# EAGLE design polarshield v1.2 2012.11.02 (EAGLE 5.11)
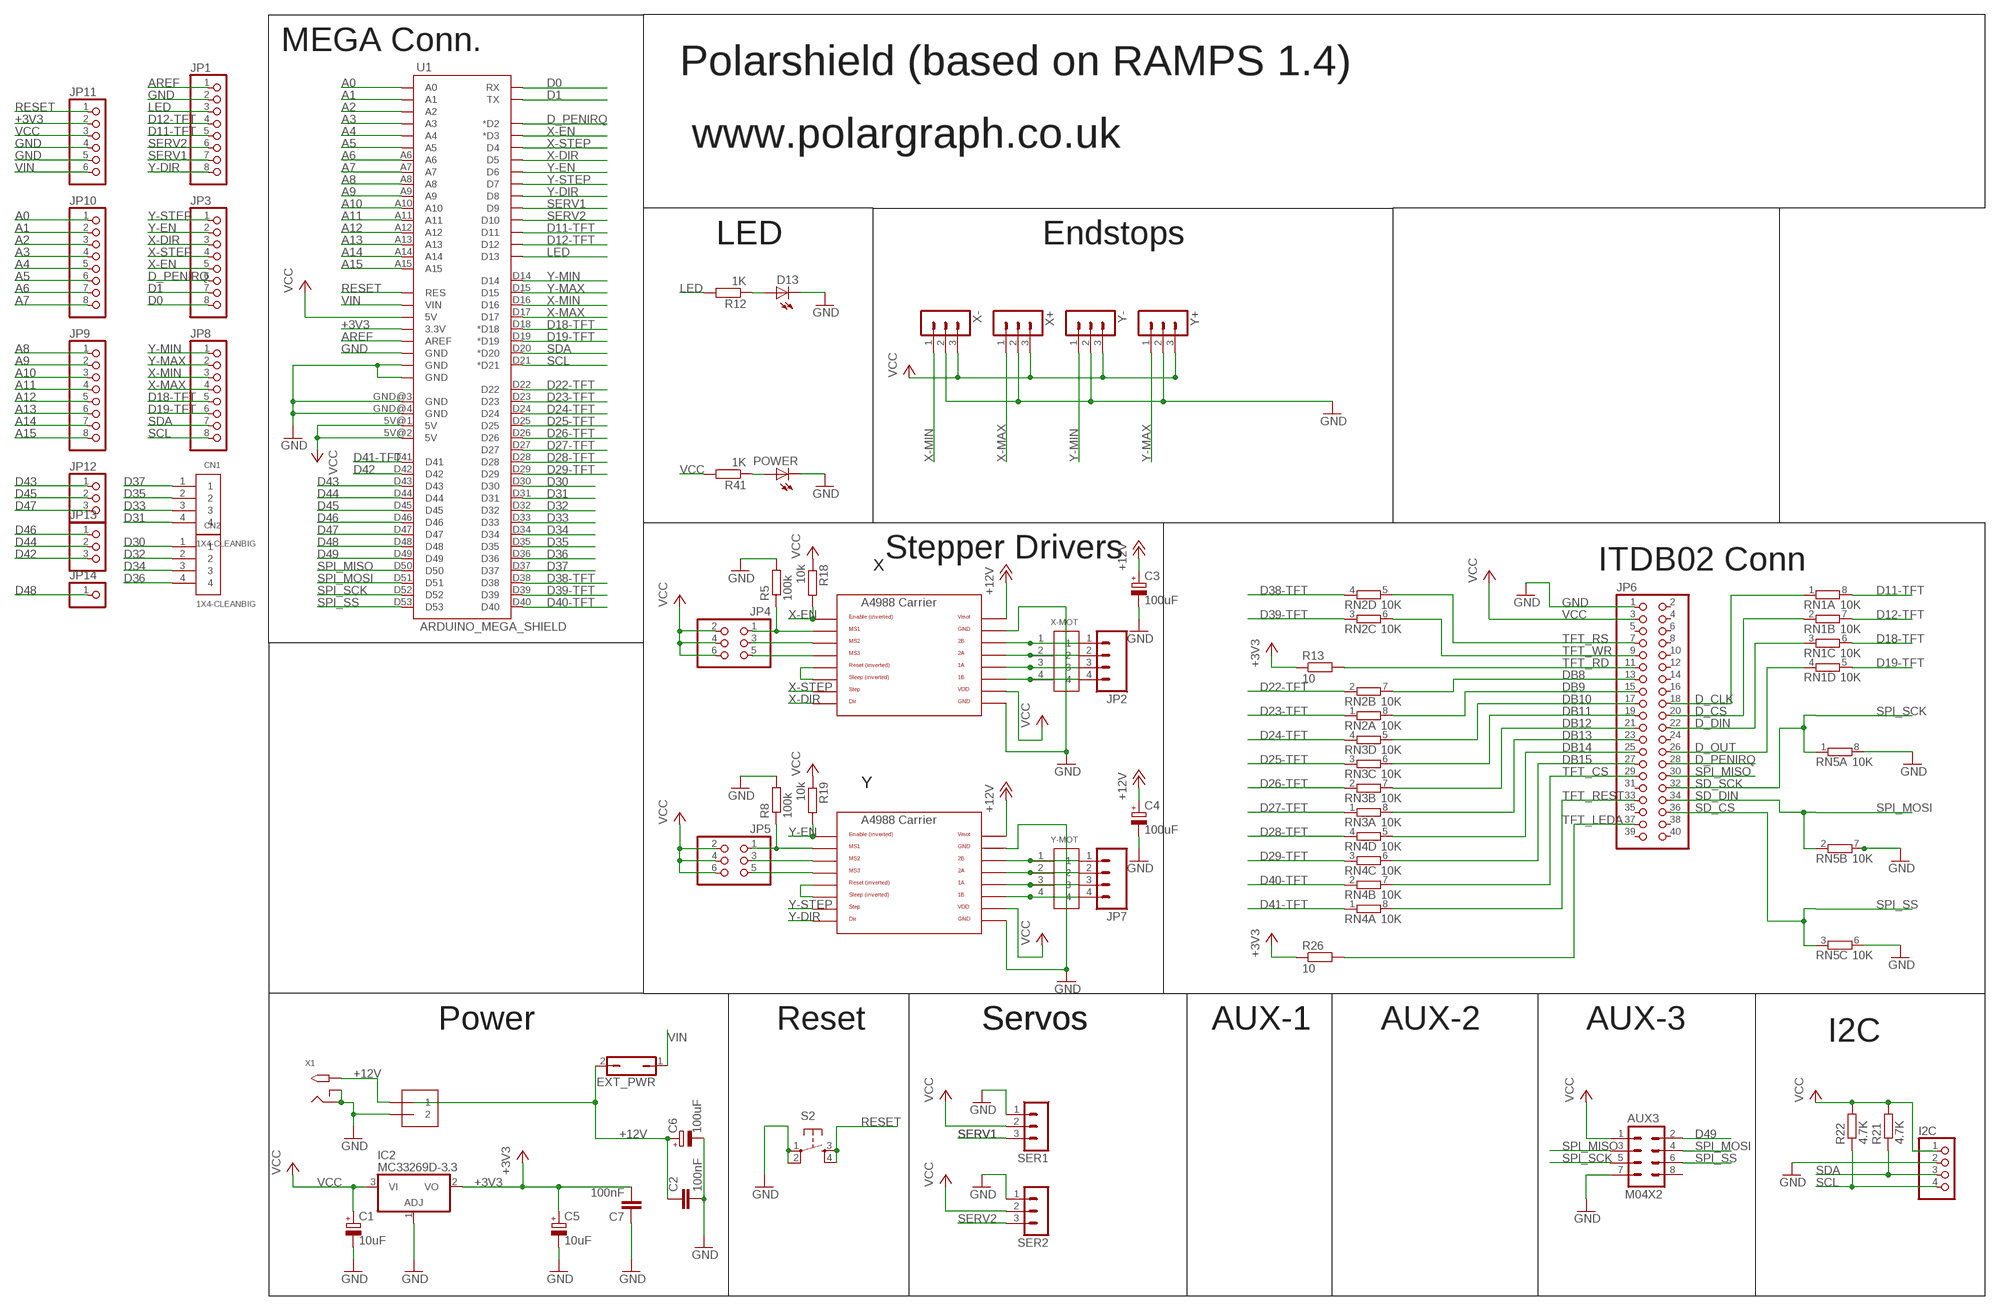
[diagram p0: schematic, sheet 1, part 1 of 2]
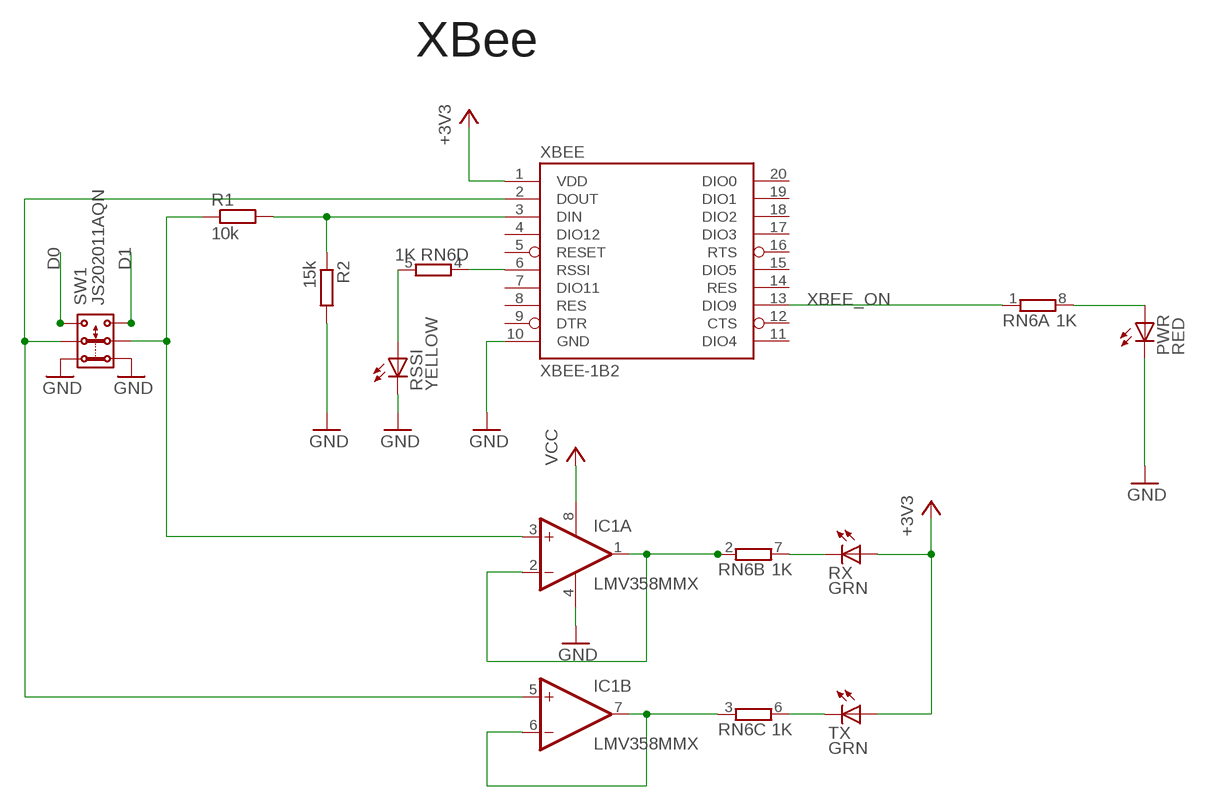
[diagram p1: schematic, sheet 1, part 2 of 2]

## Parts
AUX3  M04X2  [2X4]
C1  10uF  CPOL-EUCT3528  [CT3528]
C2  100nF  C-EUC0805  [C0805]
C3  100uF  CPOL-EU153CLV-0605  [153CLV-0605]
C4  100uF  CPOL-EU153CLV-0605  [153CLV-0605]
C5  10uF  CPOL-EUCT3528  [CT3528]
C6  100uF  CPOL-EU153CLV-0605  [153CLV-0605]
C7  100nF  C-EUC0805  [C0805]
CN1  1X4-CLEANBIG  [1X04-CLEANBIG]
CN2  1X4-CLEANBIG  [1X04-CLEANBIG]
D13  LEDCHIP-LED0805  [CHIP-LED0805]
EXT_PWR  JP1Q  [JP1]
I2C  PINHD-1X4  [1X04]
IC1  LMV358MMX  [MSOP08]
IC2  MC33269D-3.3  [DPACK]
J1  1X2-3.5MM  [1X2-3.5MM]
JP1  PINHD-1X8CLEANBIG  [1X08-CLEANBIG]
JP2  M04SCREW  [SCREWTERMINAL-3.5MM-4]
JP3  PINHD-1X8CLEANBIG  [1X08-CLEANBIG]
JP4  PINHD-2X3  [2X03]
JP5  PINHD-2X3  [2X03]
JP6  PINHD-2X20  [2X20]
JP7  M04SCREW  [SCREWTERMINAL-3.5MM-4]
JP8  PINHD-1X8CLEANBIG  [1X08-CLEANBIG]
JP9  PINHD-1X8CLEANBIG  [1X08-CLEANBIG]
JP10  PINHD-1X8CLEANBIG  [1X08-CLEANBIG]
JP11  PINHD-1X6CB  [1X06-CLEANBIG]
JP12  PINHD-1X3CB  [1X03-CLEANBIG]
JP13  PINHD-1X3CB  [1X03-CLEANBIG]
JP14  PINHD-1X1CB  [1X01-CLEANBIG]
POWER  LEDCHIP-LED0805  [CHIP-LED0805]
PWR  RED  LEDCHIPLED_0805  [CHIPLED_0805]
R1  10k  R-EU_R0805  [R0805]
R2  15k  R-EU_R0805  [R0805]
R5  100k  R-EU_R0805  [R0805]
R8  100k  R-EU_R0805  [R0805]
R12  1K  R-EU_R0805  [R0805]
R13  10  R-EU_R0805  [R0805]
R18  10k  R-EU_R0805  [R0805]
R19  10k  R-EU_R0805  [R0805]
R21  4.7K  R-EU_R0805  [R0805]
R22  4.7K  R-EU_R0805  [R0805]
R26  10  R-EU_R0805  [R0805]
R41  1K  R-EU_R0805  [R0805]
RN1  10K  4R-NEXBS8V  [EXBS8V]
RN2  10K  4R-NEXBS8V  [EXBS8V]
RN3  10K  4R-NEXBS8V  [EXBS8V]
RN4  10K  4R-NEXBS8V  [EXBS8V]
RN5  10K  4R-NEXBS8V  [EXBS8V]
RN6  1K  4R-NEXBS8V  [EXBS8V]
RSSI  YELLOW  LEDCHIPLED_0805  [CHIPLED_0805]
RX  GRN  LEDCHIPLED_0805  [CHIPLED_0805]
S2  TAC_SWITCHPTH  [TACTILE-PTH]
SER1  3PIN-HEADER  [3PIN-HEADER]
SER2  3PIN-HEADER  [3PIN-HEADER]
SW1  JS202011AQN  [JS202011AQN]
TX  GRN  LEDCHIPLED_0805  [CHIPLED_0805]
U1  ARDUINO_MEGA_SHIELD  [ARDUINO_MEGA_SHIELD]
U$6  A4988BREAKOUT  [A4988BREAKOUT]
U$7  A4988BREAKOUT  [A4988BREAKOUT]
X1  2.1MMJACKTHM  [PJ-102A]
X+  3PIN-HEADER  [3PIN-HEADER]
X-  3PIN-HEADER  [3PIN-HEADER]
X-MOT  1X4-BIG  [1X04-BIG]
XBEE  XBEE-1B2  [XBEE-SILK]
Y+  3PIN-HEADER  [3PIN-HEADER]
Y-  3PIN-HEADER  [3PIN-HEADER]
Y-MOT  1X4-BIG  [1X04-BIG]

## Nets
+3V3: C5.+ C7.2 IC2.2(VO) JP11.2 R13.1 R26.1 RX.A TX.A U1.3.3V XBEE.1(VDD)
+12V [vcc]: C2.1 C3.+ C4.+ C6.+ EXT_PWR.2 J1.1 U$6.VMOT U$7.VMOT X1.TIP
A0: JP10.1 U1.A0
A1: JP10.2 U1.A1
A2: JP10.3 U1.A2
A3: JP10.4 U1.A3
A4: JP10.5 U1.A4
A5: JP10.6 U1.A5
A6: JP10.7 U1.A6
A7: JP10.8 U1.A7
A8: JP9.1 U1.A8
A9: JP9.2 U1.A9
A10: JP9.3 U1.A10
A11: JP9.4 U1.A11
A12: JP9.5 U1.A12
A13: JP9.6 U1.A13
A14: JP9.7 U1.A14
A15: JP9.8 U1.A15
AREF: JP1.1 U1.AREF
D0: JP3.8 SW1.A3(3.1) U1.RX
D1: JP3.7 SW1.B3(3.2) U1.TX
D11-TFT: JP1.5 RN1.8 U1.D11
D12-TFT: JP1.4 RN1.7 U1.D12
D18-TFT: JP8.5 RN1.6 U1.D18(*D18)
D19-TFT: JP8.6 RN1.5 U1.D19(*D19)
D22-TFT: RN2.2 U1.D22
D23-TFT: RN2.1 U1.D23
D24-TFT: RN3.4 U1.D24
D25-TFT: RN3.3 U1.D25
D26-TFT: RN3.2 U1.D26
D27-TFT: RN3.1 U1.D27
D28-TFT: RN4.4 U1.D28
D29-TFT: RN4.3 U1.D29
D30: CN2.1 U1.D30
D31: CN1.4 U1.D31
D32: CN2.2 U1.D32
D33: CN1.3 U1.D33
D34: CN2.3 U1.D34
D35: CN1.2 U1.D35
D36: CN2.4 U1.D36
D37: CN1.1 U1.D37
D38-TFT: RN2.4 U1.D38
D39-TFT: RN2.3 U1.D39
D40-TFT: RN4.2 U1.D40
D41-TFT: RN4.1 U1.D41
D42: JP13.3 U1.D42
D43: JP12.1 U1.D43
D44: JP13.2 U1.D44
D45: JP12.2 U1.D45
D46: JP13.1 U1.D46
D47: JP12.3 U1.D47
D48: JP14.1 U1.D48
D49: AUX3.2 U1.D49
D_CLK: JP6.18 RN1.1
D_CS: JP6.20 RN1.2
D_DIN: JP6.22 RN1.3
D_OUT: JP6.26 RN1.4
D_PENIRQ: JP3.6 JP6.28 U1.D2(*D2)
DB8: JP6.13 RN2.7
DB9: JP6.15 RN2.8
DB10: JP6.17 RN3.5
DB11: JP6.19 RN3.6
DB12: JP6.21 RN3.7
DB13: JP6.23 RN3.8
DB14: JP6.25 RN4.5
DB15: JP6.27 RN4.6
GND: AUX3.7 C1.- C2.2 C3.- C4.- C5.- C6.- C7.1 D13.C I2C.2 IC1.4(P:V-) IC2.1(ADJ) J1.2 JP1.2 JP6.1 JP11.4 JP11.5 POWER.C PWR.C R2.2 R5.2 R8.2 RN5.6 RN5.7 RN5.8 RSSI.C S2.1 S2.2 SER1.1 SER2.1 SW1.A1(1.1) SW1.B1(1.2) U1.GND@0(GND) U1.GND@1(GND) U1.GND@2(GND) U1.GND@3(GND) U1.GND@4(GND) U$6.GND U$6.GND@0(GND) U$7.GND U$7.GND@0(GND) X1.RING X1.RING_SW X+.2 X-.2 XBEE.10(GND) Y+.2 Y-.2
LED: JP1.3 R12.2 U1.D13
N$1: U$6.RST U$6.SLP(SLEEP)
N$2: POWER.A R41.1
N$4: RN6.6 TX.C
N$5: RN6.5 RSSI.A
N$6: IC1.6(B:-IN) IC1.7(B:OUT) RN6.3
N$7: PWR.A RN6.8
N$8: RN6.4 XBEE.6(RSSI)
N$9: IC1.1(A:OUT) IC1.2(A:-IN) RN6.2
N$11: RN6.7 RX.C
N$13: U$7.RST U$7.SLP(SLEEP)
N$14: JP4.1 R5.1 U$6.MS1
N$15: JP4.3 U$6.MS2
N$16: IC1.3(A:+IN) R1.1 SW1.B2(2.2)
N$17: JP5.3 U$7.MS2
N$19: JP4.5 U$6.MS3
N$21: JP2.1 U$6.2B X-MOT.1
N$22: JP2.2 U$6.2A X-MOT.2
N$24: IC1.5(B:+IN) SW1.A2(2.1) XBEE.2(DOUT)
N$26: JP2.3 U$6.1A X-MOT.3
N$27: JP2.4 U$6.1B X-MOT.4
N$28: JP7.1 U$7.2B Y-MOT.1
N$29: JP7.2 U$7.2A Y-MOT.2
N$30: JP7.3 U$7.1A Y-MOT.3
N$31: JP5.5 U$7.MS3
N$32: R1.2 R2.1 XBEE.3(DIN)
N$33: JP5.1 R8.1 U$7.MS1
N$36: JP7.4 U$7.1B Y-MOT.4
N$46: D13.A R12.1
RESET: JP11.1 S2.3 S2.4 U1.RES
SCL: I2C.4 JP8.8 R22.1 U1.D21(*D21)
SD_CS: JP6.36 RN5.3
SD_DIN: JP6.34 RN5.2
SD_SCK: JP6.32 RN5.1
SDA: I2C.3 JP8.7 R21.1 U1.D20(*D20)
SERV1: JP1.7 SER1.3 U1.D9
SERV2: JP1.6 SER2.3 U1.D10
SPI_MISO: AUX3.3 JP6.30 U1.D50
SPI_MOSI: AUX3.4 U1.D51
SPI_SCK: AUX3.5 U1.D52
SPI_SS: AUX3.6 U1.D53
TFT_CS: JP6.29 RN4.7
TFT_LEDA: JP6.37 R26.2
TFT_RD: JP6.11 R13.2
TFT_REST: JP6.33 RN4.8
TFT_RS: JP6.7 RN2.5
TFT_WR: JP6.9 RN2.6
VCC: AUX3.1 C1.+ I2C.1 IC1.8(P:V+) IC2.3(VI) JP4.2 JP4.4 JP4.6 JP5.2 JP5.4 JP5.6 JP6.3 JP11.3 R18.1 R19.1 R21.2 R22.2 R41.2 SER1.2 SER2.2 U1.5V@0(5V) U1.5V@1(5V) U1.5V@2(5V) U$6.VDD U$7.VDD X+.3 X-.3 Y+.3 Y-.3
VIN [vcc]: EXT_PWR.1 JP11.6 U1.VIN
X-DIR: JP3.3 U1.D5 U$6.DIR
X-EN: JP3.5 R18.2 U1.D3(*D3) U$6.EN
X-MAX: JP8.4 U1.D17 X+.1
X-MIN: JP8.3 U1.D16 X-.1
X-STEP: JP3.4 U1.D4 U$6.STEP
XBEE_ON: RN6.1 XBEE.13(DIO9)
Y-DIR: JP1.8 U1.D8 U$7.DIR
Y-EN: JP3.2 R19.2 U1.D6 U$7.EN
Y-MAX: JP8.2 U1.D15 Y+.1
Y-MIN: JP8.1 U1.D14 Y-.1
Y-STEP: JP3.1 U1.D7 U$7.STEP
Unconnected: AUX3.8 JP6.2 JP6.4 JP6.5 JP6.6 JP6.8 JP6.10 JP6.12 JP6.14 JP6.16 JP6.24 JP6.31 JP6.35 JP6.38 JP6.39 JP6.40 RN5.4 RN5.5 XBEE.4(DIO12) XBEE.5(RESET) XBEE.7(DIO11) XBEE.8(RES) XBEE.9(DTR) XBEE.11(DIO4) XBEE.12(CTS) XBEE.14(RES) XBEE.15(DIO5) XBEE.16(RTS) XBEE.17(DIO3) XBEE.18(DIO2) XBEE.19(DIO1) XBEE.20(DIO0)

## Notes on the sheet
- MEGA Conn.
- Polarshield (based on RAMPS 1.4)
- www.polargraph.co.uk
- LED | Endstops
- XBee
- Stepper Drivers
- X | ITDB02 Conn
- Y
- Power | Reset | Servos | Servos | AUX-1 | AUX-2 | AUX-3
- I2C

## Library data of the parts
AUX3 = SparkFun:M04X2
C1 C3-C6 = rcl:CPOL-EU: POLARIZED CAPACITOR, European symbol
C2 C7 = resistor:C-EU: CAPACITOR, European symbol
CN1 CN2 X-MOT Y-MOT = adafruit:1X4: 4-pin connector
D13 POWER PWR RSSI RX TX = led:LED: LED OSRAM: - CHIPLED LG R971, LG N971, LY N971, LG Q971, LY Q971, LO R971, LY R971 LH N974, LH R974 LS Q976, LO Q976, LY Q976 LO Q996 - Hyper CHIPLED LW Q18S LB Q993, LB Q99A, LB R99A - SideLED LS A670, LO A670, LY A670, LG A670, LP A670 LB A673, LV A673, LT A673, LW A673 LH A674 LY A675 LS A676, LA A676, LO A676, LY A676, LW A676 LS A679, LY A679, LG A679 - Hyper Micro SIDELED® LS Y876, LA Y876, LO Y876, LY Y876 LT Y87S - SmartLED LW L88C, LW L88S LB L89C, LB L89S, LG L890 LS L89K, LO L89K, LY L89K LS L896, LA L896, LO L896, LY L896 - TOPLED LS T670, LO T670, LY T670, LG T670, LP T670 LSG T670, LSP T670, LSY T670, LOP T670, LYG T670 LG T671, LOG T671, LSG T671 LB T673, LV T673, LT T673, LW T673 LH T674 LS T676, LA T676, LO T676, LY T676, LB T676, LH T676, LSB T676, LW T676 LB T67C, LV T67C, LT T67C, LS T67K, LO T67K, LY T67K, LW E67C LS E67B, LA E67B, LO E67B, LY E67B, LB E67C, LV E67C, LT E67C LW T67C LS T679, LY T679, LG T679 LS T770, LO T770, LY T770, LG T770, LP T770 LB T773, LV T773, LT T773, LW T773 LH T774 LS E675, LA E675, LY E675, LS T675 LS T776, LA T776, LO T776, LY T776, LB T776 LHGB T686 LT T68C, LB T68C - Hyper Mini TOPLED® LB M676 - Mini TOPLED Santana® LG M470 LS M47K, LO M47K, LY M47K Source: http://www.osram.convergy.de LUXEON: - LUMILED® LXK2-PW12-R00, LXK2-PW12-S00, LXK2-PW14-U00, LXK2-PW14-V00 LXK2-PM12-R00, LXK2-PM12-S00, LXK2-PM14-U00 LXK2-PE12-Q00, LXK2-PE12-R00, LXK2-PE12-S00, LXK2-PE14-T00, LXK2-PE14-U00 LXK2-PB12-K00, LXK2-PB12-L00, LXK2-PB12-M00, LXK2-PB14-N00, LXK2-PB14-P00, LXK2-PB14-Q00 LXK2-PR12-L00, LXK2-PR12-M00, LXK2-PR14-Q00, LXK2-PR14-R00 LXK2-PD12-Q00, LXK2-PD12-R00, LXK2-PD12-S00 LXK2-PH12-R00, LXK2-PH12-S00 LXK2-PL12-P00, LXK2-PL12-Q00, LXK2-PL12-R00 Source: www.luxeon.com KINGBRIGHT: KA-3528ASYC Source: www.kingbright.com
EXT_PWR = jumper:JP1Q: JUMPER
I2C = RepRapjr:PINHD-1X4: PIN HEADER
IC1 = linear:LMV358?*: Dual General Purpose, Low Voltage, Rail-to-Rail Output Operational Amplifiers Source: http://www.national.com/mpf/LM/LMV321.html http://www.national.com/dt/lmv_qual.pdf
IC2 = linear:MC33269?*: Adjustable Output Low Dropout Voltage Regulator 800 mA Source: http://www.onsemi.com/pub/Collateral/MC33269-D.PDF
J1 = adafruit:1X2: 3.5mm Terminal block http://www.ladyada.net/library/pcb/eaglelibrary.html
JP1 JP3 JP8-JP10 = adafruit:PINHD-1X8: PIN HEADER
JP2 JP7 = SparkFun:M04: Header 4 Standard 4-pin 0.1" header. Use with straight break away headers (SKU : PRT-00116), right angle break away headers (PRT-00553), swiss pins (PRT-00743), machine pins (PRT-00117), and female headers (PRT-00115). Molex polarized connector foot print use with SKU : PRT-08231 with associated crimp pins and housings. 1MM SMD Version SKU: PRT-10208
JP4 JP5 = pinhead:PINHD-2X3: PIN HEADER
JP6 = pinhead:PINHD-2X20: PIN HEADER
JP11 = adafruit:PINHD-1X6: PIN HEADER
JP12 JP13 = adafruit:PINHD-1X3: PIN HEADER
JP14 = adafruit:PINHD-1X1: Pin header 1x1 for 0.1" spacing With round pins
R1 R13 R26 = resistor:R-EU_: RESISTOR, European symbol
R2 R5 R8 R12 R18 R19 R21 R22 R41 = rcl:R-EU_: RESISTOR, European symbol
RN1-RN6 = resistor-dil:4R-N: Array Chip Resistor Source: RS Component / Phycomp; OC_FARNELL: unknown; OC_NEWARK: unknown
S2 = SparkFun:TAC_SWITCH: Momentary Switch Button commonly used for reset or general input. Spark Fun Electronics SKU : COM-00097
SER1 SER2 X+ X- Y+ Y- = ultimachine:3PIN-HEADER: PIN HEADER
SW1 = sandynoble:JS202011AQN
U1 = RepRapjr:ARDUINO_MEGA_SHIELD
U$6 U$7 = RepRapjr:A4988BREAKOUT
X1 = adafruit:2.1MMJACK: 2.1mm x 5.5mm THM DC jack with internal switch. Digikey part #PJ-102A, 4UCON part #05537 2.1mm x 5.5mm SMT DC jack with internal switch. Digikey part #PJ-002A-SMT, 4UCON part #03267 By microbuilder.eu & adafruit.com
XBEE = SparkFun:XBEE-1

## Net classes
1 gnd12: width 2.54 mm
2 gnd5: width 2.54 mm
3 vmot: width 2.54 mm
4 vcc: width 0.406 mm
5 signal: width 0.406 mm

## Board
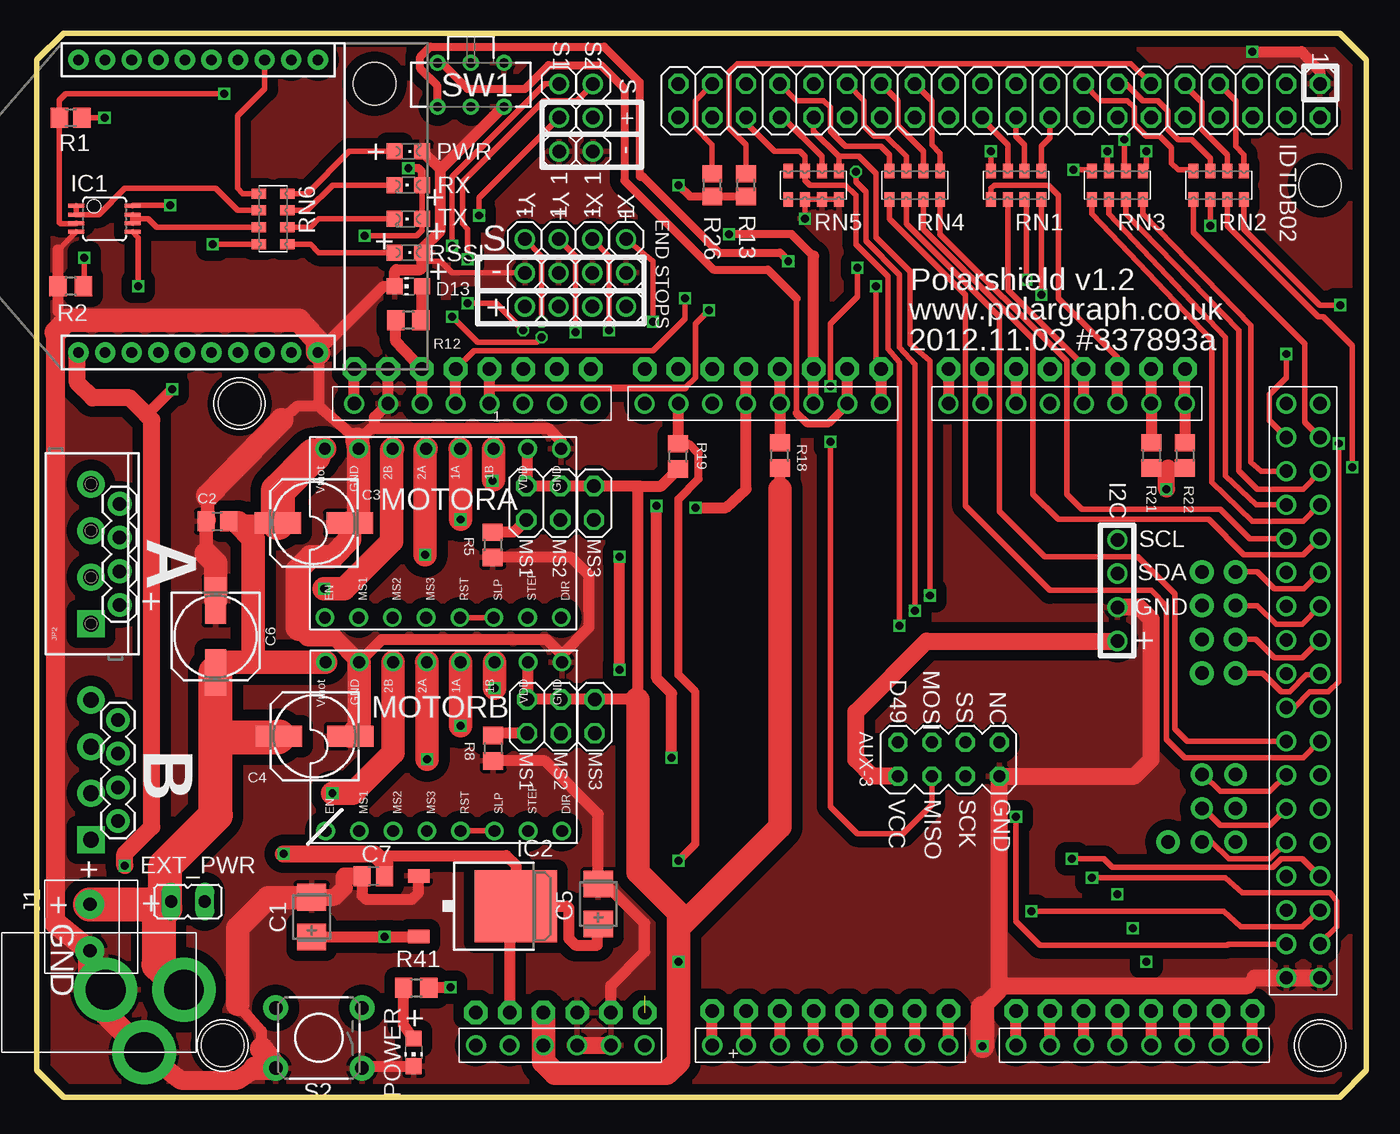
[diagram p2: board, top side]
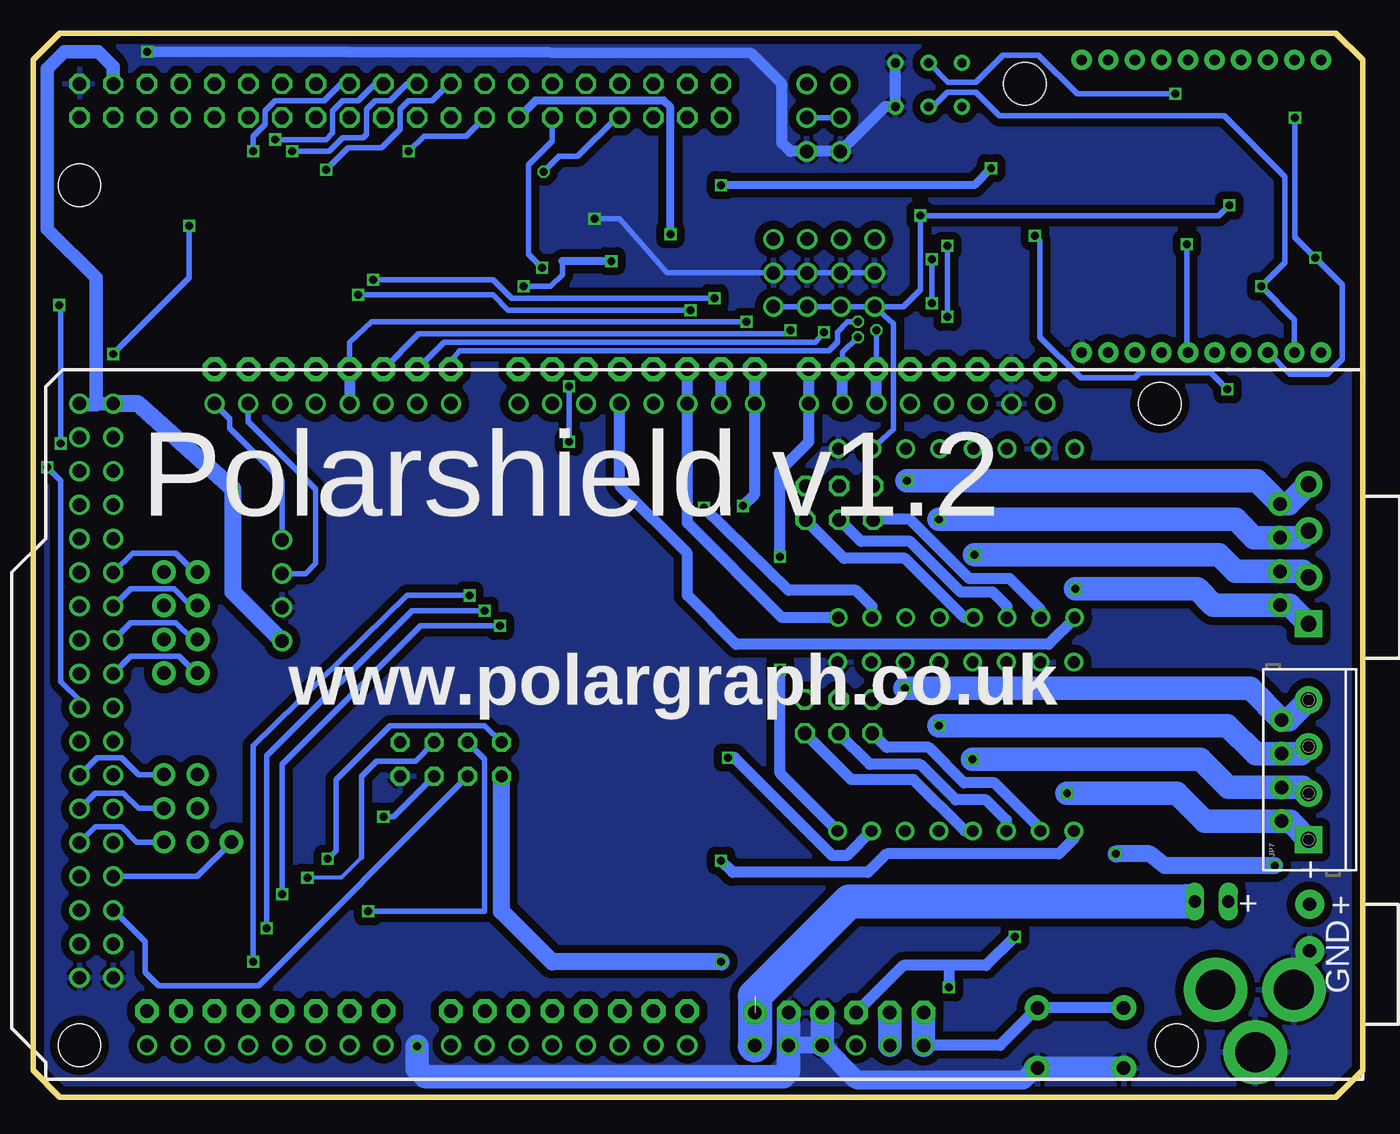
[diagram p3: board, bottom side, seen from below]

Size 100 x 80 mm. Coordinates in mm from the lower left corner, seen from the top.
Outline: 100,2 100,78 98,80 2,80 0,78 0,2 2,0 98,0 100,2
Copper layers (1*16): Top 0.035mm / dielectric 1.5mm / Bottom 0.035mm
Design rules "ITead_rule": minimum track width 6mil, minimum drill 12mil, track to track 6mil, track to pad 6mil, pad to pad 6mil, via to via 6mil, smd to smd 0mil, copper to edge 10mil, drill to drill 10mil, minimum pad ring 10mil, minimum via ring 6mil, stop-mask expansion 2mil, vias tented up to drill 100mil, thermal gap 10mil
Holes 3.2 mm at 25.4,76.2 96.52,68.58

### Footprints (pad centres in the part's own frame; a part is rotated, then mirrored left to right if it is on the bottom)
2X4 = drill 0.9 pad 1.422 octagon: 1 -3.81,-1.27; 2 -3.81,1.27; 3 -1.27,-1.27; 4 -1.27,1.27; 5 1.27,-1.27; 6 1.27,1.27; 7 3.81,-1.27; 8 3.81,1.27
CT3528 = smd 2 x 2.2: + -1.5,0; - 1.5,0
C0805 = smd 1.3 x 1.5: 1 -0.85,0; 2 0.85,0
153CLV-0605 = smd 3.5 x 1.6: + 2.7,0; - -2.7,0
1X04-CLEANBIG = drill 1.016 pad 1.778 round: 1 -3.81,0; 2 -1.27,0; 3 1.27,0; 4 3.81,0
CHIP-LED0805 = smd 1.2 x 1.2: A 0,-1.05; C 0,1.05
JP1 = drill 0.914 long: 1 0,-1.27; 2 0,1.27
1X04 = drill 1.016 round: 1 -2.54,0; 2 0,0; 3 2.54,0; 4 5.08,0
MSOP08 = smd 0.3 x 1.2: 1 -0.976,-2.113; 2 -0.326,-2.113; 3 0.324,-2.113; 4 0.974,-2.113; 5 0.974,2.112; 6 0.324,2.112; 7 -0.326,2.112; 8 -0.976,2.112
DPACK = smd 1 x 1.6: 1 -2.28,-4.8; 3 2.28,-4.8 | smd 5.4 x 6.2: 2 0,2.5
1X2-3.5MM = drill 1 pad 2.184 round: 1 1.8,0; 2 -1.7,0
1X08-CLEANBIG = drill 1.016 pad 1.778 octagon: 1 -8.89,0; 2 -6.35,0; 3 -3.81,0; 4 -1.27,0; 5 1.27,0; 6 3.81,0; 7 6.35,0; 8 8.89,0
SCREWTERMINAL-3.5MM-4 = drill 1.2 pad 2.032 square: 1 0,0 | drill 1.2 pad 2.032 round: 2 3.5,0; 3 7,0; 4 10.5,0
2X03 = drill 1.016 octagon: 1 -2.54,-1.27; 2 -2.54,1.27; 3 0,-1.27; 4 0,1.27; 5 2.54,-1.27; 6 2.54,1.27
2X20 = drill 1.016 octagon: 1 -24.13,-1.27; 2 -24.13,1.27; 3 -21.59,-1.27; 4 -21.59,1.27; 5 -19.05,-1.27; 6 -19.05,1.27; 7 -16.51,-1.27; 8 -16.51,1.27; 9 -13.97,-1.27; 10 -13.97,1.27; 11 -11.43,-1.27; 12 -11.43,1.27; 13 -8.89,-1.27; 14 -8.89,1.27; 15 -6.35,-1.27; 16 -6.35,1.27; 17 -3.81,-1.27; 18 -3.81,1.27; 19 -1.27,-1.27; 20 -1.27,1.27; 21 1.27,-1.27; 22 1.27,1.27; 23 3.81,-1.27; 24 3.81,1.27; 25 6.35,-1.27; 26 6.35,1.27; 27 8.89,-1.27; 28 8.89,1.27; 29 11.43,-1.27; 30 11.43,1.27; 31 13.97,-1.27; 32 13.97,1.27; 33 16.51,-1.27; 34 16.51,1.27; 35 19.05,-1.27; 36 19.05,1.27; 37 21.59,-1.27; 38 21.59,1.27; 39 24.13,-1.27; 40 24.13,1.27
1X06-CLEANBIG = drill 1.016 pad 1.778 octagon: 1 -6.35,0; 2 -3.81,0; 3 -1.27,0; 4 1.27,0; 5 3.81,0; 6 6.35,0
1X03-CLEANBIG = drill 1.016 pad 1.676 round: 1 -2.54,0; 2 0,0; 3 2.54,0
1X01-CLEANBIG = drill 1.016 pad 1.778 round: 1 0,0
CHIPLED_0805 = smd 1.2 x 1.2: A 0,-1.05; C 0,1.05
R0805 = smd 1.3 x 1.5: 1 -0.85,0; 2 0.85,0
R0805' = smd 1.3 x 1.5: 1 -0.95,0; 2 0.95,0
EXBS8V = smd 0.75 x 1.1: 1 -1.905,-1.07; 2 -0.635,-1.07; 3 0.635,-1.07; 4 1.905,-1.07; 5 1.905,1.07; 6 0.635,1.07; 7 -0.635,1.07; 8 -1.905,1.07
TACTILE-PTH = drill 1.016 pad 1.88 round: 1 -3.251,2.261; 2 3.251,2.261; 3 -3.251,-2.261; 4 3.251,-2.261
3PIN-HEADER = drill 1.016 round: 1 -2.54,0; 2 0,0; 3 2.54,0
JS202011AQN = drill 0.7 round: A1 -2.5,1.6; A2 0,1.6; A3 2.5,1.6; B1 -2.5,-1.7; B2 0,-1.7; B3 2.5,-1.7
ARDUINO_MEGA_SHIELD = drill 1 pad 1.422 round: 3.3V 35.56,2.54; 5V@0 38.1,2.54; 5V@1 93.98,50.8; 5V@2 96.52,50.8; A0 50.8,2.54; A1 53.34,2.54; A2 55.88,2.54; A3 58.42,2.54; A4 60.96,2.54; A5 63.5,2.54; A6 66.04,2.54; A7 68.58,2.54; A8 73.66,2.54; A9 76.2,2.54; A10 78.74,2.54; A11 81.28,2.54; A12 83.82,2.54; A13 86.36,2.54; A14 88.9,2.54; A15 91.44,2.54; AREF 23.876,50.8; D2 58.42,50.8; D3 55.88,50.8; D4 53.34,50.8; D5 50.8,50.8; D6 48.26,50.8; D7 45.72,50.8; D8 41.656,50.8; D9 39.116,50.8; D10 36.576,50.8; D11 34.036,50.8; D12 31.496,50.8; D13 28.956,50.8; D14 68.58,50.8; D15 71.12,50.8; D16 73.66,50.8; D17 76.2,50.8; D18 78.74,50.8; D19 81.28,50.8; D20 83.82,50.8; D21 86.36,50.8; D22 93.98,48.26; D23 96.52,48.26; D24 93.98,45.72; D25 96.52,45.72; D26 93.98,43.18; D27 96.52,43.18; D28 93.98,40.64; D29 96.52,40.64; D30 93.98,38.1; D31 96.52,38.1; D32 93.98,35.56; D33 96.52,35.56; D34 93.98,33.02; D35 96.52,33.02; D36 93.98,30.48; D37 96.52,30.48; D38 93.98,27.94; D39 96.52,27.94; D40 93.98,25.4; D41 96.52,25.4; D42 93.98,22.86; D43 96.52,22.86; D44 93.98,20.32; D45 96.52,20.32; D46 93.98,17.78; D47 96.52,17.78; D48 93.98,15.24; D49 96.52,15.24; D50 93.98,12.7; D51 96.52,12.7; D52 93.98,10.16; D53 96.52,10.16; GND@0 40.64,2.54; GND@1 43.18,2.54; GND@2 26.416,50.8; GND@3 93.98,7.62; GND@4 96.52,7.62; RES 33.02,2.54; RX 63.5,50.8; TX 60.96,50.8; VIN 45.72,2.54 | hole 3.2: 96.52,2.54; 13.97,2.54; 15.24,50.8
A4988BREAKOUT = drill 0.9 round: 1A 8.89,1.27; 1B 11.43,1.27; 2A 6.35,1.27; 2B 3.81,1.27; DIR 16.51,-11.43; EN -1.27,-11.43; GND 16.51,1.27; GND@0 1.27,1.27; MS1 1.27,-11.43; MS2 3.81,-11.43; MS3 6.35,-11.43; RST 8.89,-11.43; SLP 11.43,-11.43; STEP 13.97,-11.43; VDD 13.97,1.27; VMOT -1.27,1.27
PJ-102A = drill 3 pad 4.8 round: RING 0.1,-3.39; RING_SW -4.6,-6.29; TIP 0.1,-9.29
1X04-BIG = drill 1.016 pad 1.778 round: 1 0,0; 2 2.54,0; 3 5.08,0; 4 7.62,0
XBEE-SILK = drill 0.8 pad 1.524 round: 1 -11,20; 2 -11,18; 3 -11,16; 4 -11,14; 5 -11,12; 6 -11,10; 7 -11,8; 8 -11,6; 9 -11,4; 10 -11,2; 11 11,2; 12 11,4; 13 11,6; 14 11,8; 15 11,10; 16 11,12; 17 11,14; 18 11,16; 19 11,18; 20 11,20

### Placement (x,y rotation side)
AUX3  68.58,25.4 0 top
C1  20.67,13.53 90 top
C2  13.57,43.29 180 top
C3  20.83,43.17 180 top
C4  20.89,27.13 180 top
C5  42.23,14.51 90 top
C6  13.44,34.64 270 top
C7  25.31,16.62 0 top
CN1  90.17,35.69 90 top
CN2  87.63,35.69 270 bottom
D13  27.94,60.96 90 top
EXT_PWR  11.36,14.71 90 top
I2C  81.28,36.83 90 top
IC1  5.08,66.04 270 top
IC2  33.53,14.35 270 top
J1  3.99,12.7 90 top
JP1  32.77,54.74 0 top
JP2  4.06,35.6 90 top
JP3  54.61,54.74 0 top
JP4  39.36,44.68 0 top
JP5  39.41,28.63 0 top
JP6  72.39,74.93 180 top
JP7  4.06,19.36 90 bottom
JP8  77.47,54.74 0 top
JP9  82.55,6.48 0 top
JP10  59.69,6.48 0 top
JP11  39.37,6.35 0 top
JP12  90.17,21.72 270 bottom
JP13  87.63,21.72 90 top
JP14  85.09,19.18 0 top
POWER  28.34,3.35 180 top
PWR  27.94,71.12 270 top
R1  2.54,73.66 0 top
R2  15k  [R0805']  2.54,60.96 180 top
R5  100k  [R0805']  34.29,41.53 270 top
R8  100k  [R0805']  34.32,26.23 270 top
R12  1K  [R0805']  27.94,58.42 180 top
R13  53.34,68.58 90 top
R18  10k  [R0805']  55.88,48.26 90 top
R19  10k  [R0805']  48.24,48.18 90 top
R21  4.7K  [R0805']  83.82,48.26 270 top
R22  4.7K  [R0805']  86.36,48.26 270 top
R26  50.8,68.58 90 top
R41  1K  [R0805']  28.53,8.21 0 top
RN1  73.66,68.58 180 top
RN2  88.9,68.58 0 top
RN3  81.28,68.58 0 top
RN4  66.04,68.58 0 top
RN5  58.42,68.58 180 top
RN6  17.78,66.04 270 top
RSSI  27.94,63.5 270 top
RX  27.94,68.58 90 top
S2  21.21,4.45 180 top
SER1  39.28,73.65 90 top
SER2  41.82,73.65 90 top
SW1  32.64,76.07 180 top
TX  27.94,66.04 90 top
U1  0,1.35 0 top
U$6  22.93,47.49 0 top
U$7  22.98,31.44 0 top
X1  1.77,7.97 90 top
X+  44.32,61.98 270 top
X-  41.78,61.98 270 top
X-MOT  6.22,37 90 top
XBEE  23.13,67 90 top
Y+  39.24,61.98 270 top
Y-  36.7,61.98 270 top
Y-MOT  6.1,20.75 90 top

### Tracks (layer width: path | path; a pad name or v marks a point on that pad's centre or on a via)
+3V3  (via drill 0.6)
  Top 0.406: RX.A TX.A 28.99,65.19 28.57,64.77 v24.64,64.77
  Top 0.61: R13.1 R26.1 49.11,67.73 v48.26,68.58 | v27.94,69.85 28.7,69.85 28.96,69.6 28.96,68.61 RX.A
  Top 0.813: 3.05,55.92 XBEE.1 | 8.26,51.31 v10.16,53.21 | IC2.2 36.03,17.44 35.31,18.16 26.42,18.16 25.97,17.72 | IC2.2 39.88,14.35 40.01,14.22 40.01,11.94 40.51,11.43 42.16,11.43 C5.+ | JP11.2 35.56,13.88 IC2.2
  Top 1.27: C7.2 26.16,17.53 25.97,17.72 25.4,18.29 v18.54,18.29 | v6.6,17.4 6.6,18.29 8.64,20.32 8.64,50.93 8.26,51.31 6.99,52.58 4.19,52.58 3.05,53.72 3.05,55.92
  Bottom 0.406: v10.16,53.21 11.43,54.48 16.76,54.48 17.14,54.1 21.21,54.1 24.26,57.15 24.26,64.39 v24.64,64.77
  Bottom 0.61: v48.26,68.58 29.21,68.58 v27.94,69.85
  Bottom 1.27: v18.54,18.29 16,18.29 14.86,17.4 v6.6,17.4
  Bottom 1.778: JP11.2 U1.3.3V
+12V
  Top 0.813: 9.65,14.22 10.09,14.66 EXT_PWR.2
  Top 1.016: C2.1 14.55,43.17 15.12,43.17
  Top 1.27: 14.55,43.17 C3.+ | EXT_PWR.2 9.17,14.71 9.14,14.73
  Top 1.778: 20.83,48.26 21.33,48.76 U$6.VMOT | 16.38,32.71 14.21,32.71 C6.+ | 16.38,32.71 U$7.VMOT | 15.12,43.17 16.26,42.04 16.26,32.84 16.38,32.71
  Top 2.54: C3.+ 18.13,45.61 20.78,48.26 20.83,48.26 | 9.14,14.61 9.14,9.99 X1.TIP | 9.14,14.61 9.14,14.73 | J1.1 9.04,14.5 9.14,14.61 | 13.44,27.05 13.44,21.23 13.46,21.21 9.65,17.4 9.65,14.22 | 13.44,27.05 C6.+ | C4.+ 18.11,27.05 13.44,27.05
A0
  Top 0.813: U1.A0 JP10.1
A1
  Top 0.813: U1.A1 JP10.2
A2
  Top 0.813: U1.A2 JP10.3
A3
  Top 0.813: U1.A3 JP10.4
A4
  Top 0.813: U1.A4 JP10.5
A5
  Top 0.813: U1.A5 JP10.6
A6
  Top 0.813: U1.A6 JP10.7
A7
  Top 0.813: U1.A7 JP10.8
A8
  Top 0.813: U1.A8 JP9.1
A9
  Top 0.813: U1.A9 JP9.2
A10
  Top 0.813: U1.A10 JP9.3
A11
  Top 0.813: U1.A11 JP9.4
A12
  Top 0.813: U1.A12 JP9.5
A13
  Top 0.813: U1.A13 JP9.6
A14
  Top 0.813: U1.A14 JP9.7
A15
  Top 0.813: U1.A15 JP9.8
AREF
  Top 0.813: U1.AREF JP1.1
D0  (via drill 0.6)
  Top 0.406: v63.12,60.96 63.12,55.12 JP3.8
  Top 0.61: SW1.A3 30.14,76.03 28.83,77.34 28.83,78.23 29.59,78.99 42.67,78.99 45.34,76.33 45.34,69.22 45.59,69.22 51.31,63.5 55.88,63.5 v56.52,62.87
  Top 0.813: JP3.8 U1.RX
  Bottom 0.406: 60.2,62.87 60.2,61.85 61.09,60.96 v63.12,60.96
  Bottom 0.61: v56.52,62.87 60.2,62.87
D1
  Top 0.406: 57.15,60.07 57.15,51.44
  Top 0.61: SW1.B3 30.43,77.77 32.38,75.82 36.7,75.82 38.48,77.6 42.42,77.6 44.2,75.82 44.2,68.91 50.88,62.23 54.99,62.23 57.15,60.07 | U1.TX 60.96,52.07 59.56,50.67 57.91,50.67 57.15,51.44
  Top 0.813: U1.TX JP3.7
D11-TFT  (via drill 0.6)
  Top 0.406: 48.77,53.34 49.53,54.1 49.53,58.17 v50.55,59.18 | v75.56,60.33 RN1.8
  Top 0.508: 34.04,53.34 48.77,53.34
  Top 0.813: U1.D11 34.04,53.34 JP1.5
  Bottom 0.406: v75.56,60.33 65.41,60.33 64.26,59.18 v50.55,59.18
D12-TFT  (via drill 0.6)
  Top 0.406: JP1.4 32.89,56.13 46.35,56.13 48.77,58.55 v48.77,60.07 | RN1.7 74.42,67.38 v74.42,61.47
  Top 0.813: U1.D12 JP1.4
  Bottom 0.406: v74.42,61.47 65.41,61.47 64.01,60.07 v48.77,60.07
D18-TFT
  Top 0.406: RN1.6 73.03,60.71 78.74,54.99 JP8.5
  Top 0.813: U1.D18 JP8.5
D19-TFT
  Top 0.406: RN1.5 71.75,68.33 72.01,68.58 76.07,68.58 76.83,67.82 76.83,60.07 81.28,55.63 JP8.6
  Top 0.813: U1.D19 JP8.6
D22-TFT  (via drill 0.6)
  Top 0.406: v88.27,65.53 RN2.2 | v93.98,55.88 93.98,54.1 92.71,52.83 92.71,50.88 U1.D22
  Bottom 0.406: v88.27,65.53 88.27,61.59 v93.98,55.88
D23-TFT
  Top 0.406: RN2.1 87,65.02 95.38,56.64 95.38,50.75 U1.D23
D24-TFT
  Top 0.406: U1.D24 92.12,47.07 91.31,47.75 91.31,58.04 83.19,66.42 RN3.4
D25-TFT
  Top 0.406: U1.D25 96.52,46.99 95.25,45.72 91.82,45.72 90.42,47.12 90.42,57.66 81.92,66.42 RN3.3
D26-TFT
  Top 0.406: U1.D26 91.74,44.53 89.41,46.74 89.41,57.15 80.64,66.42 RN3.2
D27-TFT
  Top 0.406: U1.D27 96.47,44.53 95.25,43.31 91.44,43.31 88.39,46.23 88.39,56.9 79.38,66.42 RN3.1
D28-TFT
  Top 0.406: U1.D28 91.23,41.99 89.03,44.2 78.61,44.2 77.47,45.34 77.47,55.37 67.94,64.9 RN4.4
D29-TFT
  Top 0.406: RN4.3 66.67,65.28 74.93,57.02 74.93,45.34 76.83,43.43 88.14,43.43 90.81,40.77 95.25,40.77 96.47,41.99 U1.D29
D30
  Bottom 0.406: CN2.1 87.88,39.5 89.28,40.89 92.54,40.89 U1.D30
D31
  Top 0.406: CN1.4 91.82,39.5 93.09,38.23 95.3,38.23 U1.D31
D32
  Bottom 0.406: CN2.2 88.14,36.96 89.41,38.23 92.66,38.23 U1.D32
D33
  Top 0.406: CN1.3 91.82,36.96 93.22,35.56 95.17,35.56 U1.D33
D34
  Bottom 0.406: CN2.3 88.01,34.42 89.28,35.69 92.66,35.69 U1.D34
D35
  Top 0.406: CN1.2 91.69,34.42 93.09,33.02 95.17,33.02 U1.D35
D36
  Bottom 0.406: CN2.4 87.76,31.88 89.03,33.15 92.66,33.15 U1.D36
D37
  Top 0.406: CN1.1 92.2,31.88 93.6,30.48 94.23,30.48 95.5,31.75 96.44,31.75 U1.D37
D38-TFT  (via drill 0.6)
  Top 0.406: v98.04,59.56 96.52,59.56 90.81,65.28 RN2.4 | v97.92,49.15 97.92,31.24 97.16,30.48 95.76,30.48 94.57,29.29 U1.D38
  Bottom 0.406: v98.04,59.56 97.92,59.44 v97.92,49.15
D39-TFT  (via drill 0.6)
  Top 0.406: RN2.3 89.53,65.53 96.39,58.67 96.77,58.67 98.93,56.52 v98.93,47.37
  Bottom 0.406: U1.D39 96.52,29.84 97.92,31.24 97.92,46.35 v98.93,47.37
D40-TFT
  Top 0.406: RN4.2 65.41,65.66 72.39,58.67 72.39,44.07 75.82,40.64 82.8,40.64 85.6,37.85 85.6,27.69 86.53,26.75 U1.D40
D41-TFT
  Top 0.406: RN4.1 64.14,66.04 69.85,60.33 69.85,44.45 76.2,38.1 83.82,38.1 84.96,36.96 84.96,26.92 86.36,25.53 95.25,25.53 96.47,26.75 U1.D41
D42
  Top 0.406: JP13.3 87.76,24.26 89.03,22.99 92.76,22.99 U1.D42
D43
  Bottom 0.406: JP12.1 92.08,24.26 93.34,25.53 95.2,25.53 U1.D43
D44
  Top 0.406: JP13.2 87.76,21.72 89.03,20.45 92.76,20.45 U1.D44
D45
  Bottom 0.406: JP12.2 92.08,21.72 93.22,22.86 95.33,22.86 U1.D45
D46
  Top 0.406: JP13.1 88.39,19.18 89.66,17.91 92.76,17.91 U1.D46
D47
  Bottom 0.406: JP12.3 92.2,19.18 93.34,20.32 95.33,20.32 U1.D47
D48
  Bottom 0.406: U1.D48 87.68,16.59 JP14.1
D49  (via drill 0.6)
  Top 0.406: U1.D49 95.2,17.91 93.6,17.91 92.96,17.27 80.9,17.27 80.26,17.91 v77.85,17.91
  Bottom 0.406: AUX3.2 66.04,27.94 73.15,27.94 77.22,23.88 77.22,18.54 v77.85,17.91
D_CLK
  Top 0.406: JP6.18 76.2,72.14 75.56,71.5 RN1.1
D_CS
  Top 0.406: JP6.20 73.66,72.26 74.3,71.63 RN1.2
D_DIN
  Top 0.406: JP6.22 71.12,73.53 73.03,71.63 RN1.3
D_OUT  (via drill 0.6)
  Top 0.406: v71.75,71.12 RN1.4
  Bottom 0.406: JP6.26 67.44,72.26 70.61,72.26 v71.75,71.12
D_PENIRQ  (via drill 0.6)
  Top 0.406: U1.D2 JP3.6
  Top 0.61: v52.07,64.9 56.77,64.9 58.42,63.25
  Top 0.813: U1.D2 58.42,63.25
  Bottom 0.61: JP6.28 62.23,74.93 52.58,74.93 52.07,74.42 v52.07,64.9
DB8
  Top 0.406: JP6.13 81.92,76.2 83.19,74.93 84.33,74.93 85.09,74.17 85.09,72.77 85.85,72.01 86.87,72.01 88.27,70.61 RN2.7
DB9
  Top 0.406: JP6.15 80.01,74.93 82.04,74.93 82.55,74.42 82.55,73.15 83.44,72.26 84.45,72.26 85.34,71.37 85.34,70.23 85.85,69.72 86.92,69.72 RN2.8
DB10  (via drill 0.6)
  Top 0.406: v83.44,71.12 83.44,69.9 RN3.5
  Bottom 0.406: JP6.17 76.83,76.2 78.11,74.93 81.79,74.93 82.55,74.17 82.55,73.15 83.44,72.26 v83.44,71.12
DB11  (via drill 0.6)
  Top 0.406: v81.79,72.01 81.79,69.78 RN3.6
  Bottom 0.406: JP6.19 74.3,76.2 75.56,74.93 76.71,74.93 77.47,74.17 77.47,72.52 77.98,72.01 v81.79,72.01
DB12  (via drill 0.6)
  Top 0.406: v80.52,71.12 80.52,69.78 RN3.7
  Bottom 0.406: JP6.21 71.88,76.2 73.15,74.93 74.3,74.93 74.93,74.3 74.93,72.39 75.18,72.14 76.71,72.14 77.72,71.12 v80.52,71.12
DB13  (via drill 0.6)
  Top 0.406: v77.98,69.72 79.3,69.72 RN3.8
  Bottom 0.406: JP6.23 68.71,76.2 69.98,74.93 71.75,74.93 72.39,74.3 72.39,72.77 73.79,71.37 76.33,71.37 v77.98,69.72
DB14
  Top 0.406: JP6.25 67.31,74.93 67.31,71.63 67.94,70.99 RN4.5
DB15
  Top 0.406: JP6.27 64.77,74.93 64.77,73.03 66.67,71.12 RN4.6
GND  (via drill 0.6)
  Top 0.406: 24.44,16.64 C7.1 | 1.59,63.69 IC1.4 | 28.83,62.23 28.99,62.39 | 26.92,62.1 27.05,62.23 | D13.C 26.92,60.99 | 28.99,63.79 RSSI.C 28.99,62.99 29.12,62.87 30.35,62.87 31.24,61.98 Y-.2 | v57.78,66.04 RN5.6 RN5.7 RN5.8
  Top 0.61: 35.07,74.47 SW1.A1
  Top 0.813: 21.21,51.94 24.07,49.46 | 18.41,50.93 19.56,51.94 21.21,51.94 | U$6.GND 39.44,49.33 38.48,50.29 25.4,50.29 | 25.4,50.29 25.13,50.29 24.11,49.27 | 39.49,33.28 U$7.GND | 39.49,33.28 38.35,34.42 25.96,34.42 U$7.GND@0 | R8.2 38.22,25.28 42.23,21.27 C5.- 42.79,16.01 45.72,13.08 45.72,10.92 43.18,8.38 JP11.5 | R5.2 40.19,40.58 41.53,39.24 41.53,35.32 39.49,33.28 | POWER.C 24.58,2.3 S2.1 | 16.89,3.63 16.89,4.95 15.11,6.99 | 20.62,14.99 C1.- | 2.29,58.42 1.59,59.12 R2.2 1.59,63.69 | 28.99,62.39 28.99,62.99 | 27.05,62.23 28.83,62.23 | 26.92,60.99 26.92,62.1 | D13.C 26.09,60.96 XBEE.10 | 28.99,63.79 30.35,65.15 30.35,69.76 | 30.35,69.76 PWR.C | JP6.1 96.52,77.09 95.12,78.61 v91.44,78.61 | 30.35,69.76 35.07,74.47 | 91.06,8.38 91.65,8.97 | 72.39,8 72.77,8.38 | 21.21,55.92 21.21,51.94 | C7.1 24.46,15.16 24.77,14.86 28.19,14.86 28.7,15.37 28.7,16.61 IC2.1 | JP1.2 U1.GND@2 25.4,51.13 25.4,50.29
  Top 1.016: C2.2 12.72,40.87 | 12.83,45.21 12.83,43.4
  Top 1.27: C1.- 22.39,15.03 23.11,15.75 23.11,16.64 24.44,16.64 | U1.GND@0 U1.GND@1 | 13.46,37.36 C6.- | 24.2,43.84 C3.- | 12.83,43.4 C2.2 | 19.68,35.18 20.32,34.54 22.42,34.54 U$7.GND@0 | U1.GND@4 U1.GND@3 91.65,8.97 | 71.12,6.73 72.39,8 AUX3.7 82.55,24.13 83.82,25.4 83.82,35.94 82.93,36.83 I2C.2 | 72.77,8.38 91.06,8.38
  Top 1.422: 1.4,13.08 1.4,57.53 | 16.41,2.18 15.11,1.27 10.79,1.27 X1.RING_SW
  Top 1.676: 1.4,57.53 2.29,58.42 | J1.2 1.4,13.08
  Top 1.778: J1.2 3.99,9.24 X1.RING 5.16,6.27 X1.RING_SW | 12.72,40.87 13.46,40.13 13.46,37.36 | 24.2,43.84 U$6.GND@0 24.11,49.27 24.07,49.46 | 18.41,50.93 12.83,45.21 | 2.29,58.42 19.68,58.42 21.13,56.85 XBEE.10 21.21,55.92 | U$7.GND@0 24.25,27.8 C4.- | 16.41,2.18 S2.2 16.89,3.63 | C3.- 23.53,41.94 22.23,40.64 20.57,40.64 19.56,39.62 19.56,35.31 19.68,35.18 | 15.11,6.99 15.11,12.7 17.4,14.99 20.62,14.99 | v71.12,3.81 71.12,6.73
  Bottom 0.406: Y-.2 Y+.2 X-.2 X+.2 52.32,61.98 55.88,66.04 v57.78,66.04
  Bottom 0.813: SW1.B1 SW1.A1 35.92,74.47 SER1.1 SER2.1 | SER2.1 | v91.44,78.61 45.97,78.49 43.69,76.2 43.69,71.75 43.05,71.12 41.83,71.12 SER2.1
  Bottom 1.27: U1.GND@0 U1.GND@1
  Bottom 1.422: 24.61,2.18 25.53,1.27 38.02,1.27 U1.GND@0
  Bottom 1.778: S2.2 S2.1 24.61,2.18 | v71.12,3.81 71.12,2.16 70.48,1.52 43.56,1.52 43.18,1.91 U1.GND@1 JP11.5 | U1.GND@0 JP11.4
  pour Top (isolate 0.813): 0,81.28 101.6,81.28 101.6,-2.54 0,0
  pour Bottom (isolate 0.61): 0,81.28 101.6,81.28 101.6,-2.54 0,-7.62
LED
  Top 0.813: R12.2 26.99,56.83 JP1.3 U1.D13
N$1
  Top 0.406: U$6.RST U$6.SLP
N$2
  Top 0.813: R41.1 27.58,5.42 POWER.A
N$4
  Top 0.406: TX.C 21.21,66.04 20.57,65.41 RN6.6
N$5
  Top 0.406: RSSI.A 21.21,63.5 20.57,64.14 RN6.5
N$6
  Top 0.406: IC1.7 IC1.6 7.52,66.04 8.38,66.04 9.02,65.41 RN6.3
N$7
  Top 0.406: PWR.A 23.5,71.12 20.32,67.94 RN6.8
N$8  (via drill 0.6)
  Top 0.406: v13.21,64.14 RN6.4
  Bottom 0.406: v13.21,64.14 13.21,56.08 XBEE.6
N$9
  Top 0.406: IC1.1 IC1.2 4.64,66.37 6.6,68.33 13.46,68.33 15.11,66.67 RN6.2
N$11
  Top 0.406: RX.C 22.23,68.58 20.32,66.67 RN6.7
N$13
  Top 0.406: U$7.RST U$7.SLP
N$14
  Top 0.813: R5.1 35.89,42.48 JP4.1
  Bottom 0.813: U$6.MS1 24.2,36.65 26.54,38.99 29.59,38.99 34.04,43.43 36.8,43.43 JP4.1
N$15
  Bottom 0.813: U$6.MS2 26.74,36.9 27.81,37.97 30.23,37.97 34.04,41.78 37.73,41.78 JP4.3
N$16  (via drill 0.6)
  Top 0.406: IC1.3 2.91,65.66 1.78,65.66 1.69,65.75 R1.1 1.69,74.97 2.16,75.44 v14.1,75.44
  Bottom 0.406: SW1.B2 31.19,76.33 29.08,76.33 27.05,78.36 24.38,78.36 21.46,75.44 v14.1,75.44
N$17
  Bottom 0.813: U$7.MS2 26.79,20.82 28.32,22.35 30.61,22.35 33.27,25.02 37.07,25.02 JP5.3
N$19
  Bottom 0.813: U$6.MS3 29.96,36.06 34.42,40.51 39,40.51 JP4.5
N$21  (via drill 0.6)
  Top 1.778: v21.59,38.23 23.11,38.23 26.67,41.78 26.67,48.69 U$6.2B
  Bottom 1.778: JP2.1 5.46,37 X-MOT.1 11.22,37 12.45,38.23 v21.59,38.23
N$22  (via drill 0.6)
  Top 1.778: v29.21,40.77 29.21,48.69 U$6.2A
  Bottom 1.778: JP2.2 4.5,39.54 X-MOT.2 9.56,39.54 10.79,40.77 v29.21,40.77
N$24  (via drill 0.6)
  Top 0.406: v7.62,60.96 7.62,64.64 IC1.5
  Bottom 0.406: XBEE.2 5.13,58.47 v7.62,60.96 5.84,62.74 5.84,69.22 10.41,73.79 27.3,73.79 29.08,75.56 31.24,75.56 32.33,74.47 SW1.A2
N$26  (via drill 0.6)
  Top 1.778: v31.88,43.43 31.88,48.7 U$6.1A
  Bottom 1.778: JP2.3 4.59,42.08 X-MOT.3 8.17,42.08 9.53,43.43 v31.88,43.43
N$27  (via drill 0.6)
  Top 0.406: v34.29,46.35 34.36,46.42
  Top 1.778: 34.36,46.42 U$6.1B
  Bottom 1.778: v34.29,46.35 7.96,46.35 X-MOT.4 5.55,44.62 JP2.4
N$28  (via drill 0.6)
  Top 1.778: v22.23,22.86 23.75,22.86 26.8,25.91 U$7.2B
  Bottom 1.778: JP7.1 5.45,20.75 Y-MOT.1 11.86,20.75 13.97,22.86 v22.23,22.86
N$29  (via drill 0.6)
  Top 1.778: v29.34,25.4 U$7.2A
  Bottom 1.778: JP7.2 4.49,23.29 Y-MOT.2 10.08,23.29 12.19,25.4 v29.34,25.4
N$30  (via drill 0.6)
  Top 1.778: v31.88,27.94 U$7.1A
  Bottom 1.778: JP7.3 4.59,25.83 Y-MOT.3 8.05,25.83 10.16,27.94 v31.88,27.94
N$31
  Bottom 0.813: U$7.MS3 29.92,20.01 33.78,23.88 38.47,23.88 JP5.5
N$32  (via drill 0.6)
  Top 0.406: v3.56,63.12 3.56,61.03 R2.1 | v5.08,73.66 R1.2
  Bottom 0.406: XBEE.3 7.11,56 5.46,54.36 2.67,54.36 1.52,55.5 1.52,61.09 v3.56,63.12 5.08,64.64 v5.08,73.66
N$33
  Top 0.813: JP5.1 34.5,27.36 R8.1
  Bottom 0.813: U$7.MS1 24.25,20.19 27.69,23.62 29.97,23.62 32.64,26.29 35.8,26.29 JP5.1
N$36  (via drill 0.6)
  Top 1.27: v34.42,30.73 v34.41,30.74
  Top 1.778: v34.41,30.74 U$7.1B
  Bottom 1.778: JP7.4 5.55,28.37 Y-MOT.4 8.46,30.73 v34.42,30.73
N$46
  Top 0.406: R12.1 28.99,58.52
  Top 0.813: 28.99,58.52 D13.A
RESET
  Bottom 0.813: U1.RES 27.28,3.89 S2.3 S2.4
  Bottom 1.778: U1.RES JP11.1
SCL
  Top 0.813: R22.1 U1.D21 JP8.8
  Bottom 0.406: I2C.4 81.28,46.35 85.22,50.29 85.22,51.01 U1.D21
SD_CS  (via drill 0.6)
  Top 0.406: JP6.36 53.34,73.28 55.5,71.12 57.4,71.12 57.78,70.74 RN5.3 57.78,68.96 58.17,68.58 60.83,68.58 61.59,67.82 61.59,64.14 64.01,61.72 64.01,56.26 64.9,55.24 v64.9,35.43
  Bottom 0.406: v81.28,15.24 81.28,25.02 70.87,35.43 v64.9,35.43
SD_DIN  (via drill 0.6)
  Top 0.406: JP6.34 56.13,73.66 59.05,70.74 RN5.2 | v61.59,69.6 61.59,68.83 62.36,68.07 62.36,64.39 64.9,61.85 64.9,56.39 66.04,55.12 v66.04,36.58 66.04,36.45
  Bottom 0.406: v82.42,12.7 82.42,25.65 71.5,36.58 v66.04,36.58 | JP6.34 56.13,73.66 59.05,70.74 60.45,70.74 v61.59,69.6
SD_SCK  (via drill 0.6)
  Top 0.406: JP6.32 58.42,72.64 60.33,70.74 | 60.33,70.74 RN5.1 | 60.33,70.74 61.85,70.74 63.12,69.47 63.12,64.64 65.66,62.1 65.66,56.64 67.18,55.37 v67.18,37.72
  Bottom 0.406: v83.44,10.16 83.44,26.42 71.88,37.72 v67.18,37.72
SDA
  Top 0.813: R21.1 U1.D20 JP8.7
  Bottom 0.406: I2C.3 79.5,39.37 78.74,40.13 78.74,45.72 83.82,50.8 U1.D20
SERV1  (via drill 0.6)
  Top 0.406: v31.24,64.01 31.24,69.22 38.23,76.2 SER1.3 | v37.97,57.15 37.59,56.77 33.15,56.77 v31.24,58.67
  Bottom 0.406: v37.97,57.15 39.12,56.01 JP1.7 | v31.24,58.67 v31.24,64.01
  Bottom 0.813: U1.D9 JP1.7
SERV2  (via drill 0.6)
  Top 0.406: SER2.3 41.82,76.11 40.64,74.93 38.1,74.93 32,68.83 32,65.66 32.38,65.28 v32.38,62.99 | v36.58,57.66 34.54,59.69 v32.38,59.69
  Bottom 0.406: v32.38,59.69 v32.38,62.99 | JP1.6 v36.58,57.66
  Bottom 0.813: U1.D10 JP1.6
SPI_MISO  (via drill 0.6)
  Top 0.406: v59.69,49.28 59.69,21.84 61.72,19.81 65.15,19.81 67.31,21.97 AUX3.3 | v61.72,62.36 61.72,60.2 59.69,58.17 v59.69,53.47
  Bottom 0.406: JP6.30 60.96,71.88 62.74,70.1 62.74,63.37 v61.72,62.36 | U1.D50 93.93,14.05 91.57,11.68 91.57,9.4 90.55,8.38 83.06,8.38 AUX3.3 | v59.69,49.28 v59.69,53.47
SPI_MOSI  (via drill 0.6)
  Top 0.406: U1.D51 95.17,12.83 90.55,12.83 89.28,13.97 v74.8,13.97
  Bottom 0.406: v74.8,13.97 66.04,13.97 66.04,25.4 AUX3.4
SPI_SCK  (via drill 0.6)
  Top 0.406: v73.66,21.08 73.66,13.21 75.44,11.43 89.53,11.43 89.61,11.51 U1.D52
  Bottom 0.406: v73.66,21.08 72.9,21.08 AUX3.5
SPI_SS  (via drill 0.6)
  Top 0.406: U1.D53 96.52,11.56 97.79,12.83 97.79,14.73 97.28,15.37 90.68,15.37 89.41,16.51 v79.38,16.51
  Bottom 0.305: v79.38,16.51 76.83,16.51 75.31,18.03
  Bottom 0.406: 75.31,18.03 75.31,24.13 74.17,25.27 71.25,25.27 AUX3.6
TFT_CS
  Top 0.406: JP6.29 62.23,74.93 62.23,73.03 62.99,72.26 63.88,72.26 65.41,70.74 RN4.7
TFT_LEDA
  Top 0.406: R26.2 50.8,71.63 49.53,72.9 49.53,74.93 JP6.37
TFT_RD
  Top 0.406: R13.2 53.34,71.63 52.07,72.9 52.07,77.09 52.7,77.72 82.3,77.72 JP6.11
TFT_REST
  Top 0.406: JP6.33 57.15,74.93 59.18,74.93 59.69,74.42 59.69,72.64 60.83,71.5 63.5,71.5 64.14,70.87 RN4.8
TFT_RS
  Top 0.406: JP6.7 90.17,74.93 90.17,71.5 90.81,70.87 RN2.5
TFT_WR
  Top 0.406: JP6.9 86.36,76.07 87.63,74.8 87.63,72.77 89.53,70.87 RN2.6
VCC  (via drill 0.6)
  Top 0.406: v33.27,66.29 33.27,67.64 SER1.2 | v10.03,67.06 7.23,67.06 IC1.8 | R21.2 85.09,47.31 R22.2
  Top 0.813: U$6.VDD 36.9,46.03 JP4.2 JP4.4 JP4.6 45.34,45.95 | U$7.VDD 36.95,29.98 JP5.2 JP5.4 JP5.6 45.16,29.9 | 45.21,29.84 45.21,45.82 45.34,45.95 | 45.34,45.95 46.96,45.95 R19.1 48.32,47.31 | 55.88,45.72 R18.1 | 45.21,22.23 45.34,22.35 | R41.2 31.07,8.21 v31.11,8.26 | IC2.3 v26.16,12.06 20.7,12.06 C1.+
  Top 1.27: v84.96,45.72 84.96,47.18 85.09,47.31 | I2C.1 66.93,34.29 61.59,28.96 61.59,25.4 62.87,24.13 AUX3.1
  Top 1.778: 48.26,12.7 v48.26,10.16 48.26,2.67 47.37,1.78 38.99,1.78 38.1,2.67 U1.5V@0 JP11.3 | 48.26,12.7 48.26,13.84 45.21,16.89 45.21,22.23 45.21,29.84 45.16,29.9 | 55.88,45.72 55.88,20.32 48.26,12.7
  Bottom 0.406: X+.3 X-.3 Y+.3 Y-.3 | Y-.3 35.31,58.17 35.31,50.23 U$6.VDD | SER1.2 | Y-.3 34.54,59.44 33.27,60.71 v33.27,66.29 10.79,66.29 v10.03,67.06 | SER1.2 SER2.2 | SER2.2
  Bottom 0.813: 31.11,9.91 34.54,9.91 JP11.3 | 31.11,9.91 v31.11,8.26 | 31.11,9.91 28.32,9.91 v26.16,12.06
  Bottom 1.016: JP6.3 93.98,77.47 95.12,78.61 97.66,78.61 98.93,77.34 98.93,65.28 95.25,61.59 95.25,52.07 | 95.25,52.07 96.44,52.07 U1.5V@2 | U1.5V@1 95.17,52.15 95.25,52.07
  Bottom 1.27: AUX3.1 64.77,13.97 60.96,10.16 v48.26,10.16 | U1.5V@1 92.16,52.15 v84.96,45.72 84.96,37.97 I2C.1
VIN  (1 unrouted)
  Bottom 1.27: 13.21,14.73 12.65,14.73 EXT_PWR.1
  Bottom 2.54: U1.VIN 45.72,7.62 38.63,14.71 13.23,14.71 13.21,14.73
X-DIR
  Bottom 0.813: U$6.DIR 43.68,36.06 50.8,43.18 U1.D5 JP3.3
X-EN
  Top 0.813: R18.2 U1.D3 JP3.5
  Bottom 0.813: U$6.EN 21.66,36 23.62,34.04 47.12,34.04 50.8,37.72 50.8,40.89 55.88,45.97 U1.D3
X-MAX  (via drill 0.6)
  Top 0.406: X+.1 46.35,62.87 v46.35,58.29
  Bottom 0.406: v46.35,58.29 74.55,58.29 76.2,56.77 JP8.4
  Bottom 0.813: JP8.4 U1.D17
X-MIN  (via drill 0.6)
  Top 0.406: v43.05,57.66 43.05,63.25 X-.1
  Top 0.813: JP8.3 U1.D16
  Bottom 0.406: v43.05,57.66 43.31,57.4 70.99,57.4 JP8.3
X-STEP  (via drill 0.6)
  Top 0.813: v49.53,44.32 51.82,44.32 53.34,45.72 U1.D4 JP3.4
  Bottom 0.813: U$6.STEP 36.9,36.9 38.1,38.1 43.18,38.1 v49.53,44.32
XBEE_ON
  Top 0.406: RN6.1 15.49,67.94 15.11,68.33 15.11,73.79 17.14,75.82 17.14,77.98 XBEE.13
Y-DIR  (via drill 0.6)
  Top 0.813: v43.81,32.13 v43.81,40.64
  Bottom 0.813: v43.81,40.64 43.81,47.12 41.66,49.28 U1.D8 JP1.8 | v43.81,32.13 43.81,24.34 U$7.DIR
Y-EN  (via drill 0.6)
  Top 0.61: R19.2 49.04,49.13 49.78,48.39 49.78,46.48 48.26,44.96 48.26,31.75 49.53,30.48 49.53,19.05 v48.26,17.78
  Top 0.813: U1.D6 48.26,49.15 R19.2
  Bottom 0.813: U$7.EN 21.71,19.44 22.86,18.29 35.81,18.29 37.21,16.89 47.37,16.89 v48.26,17.78 | U1.D6 JP3.2
Y-MAX  (via drill 0.6)
  Top 0.406: v40.51,57.53 40.51,63.25 Y+.1
  Top 0.813: JP8.2 U1.D15
  Bottom 0.406: v40.51,57.53 41.15,56.77 69.09,56.77 JP8.2
Y-MIN  (via drill 0.6)
  Top 0.406: v37.97,58.29 37.97,63.25 Y-.1
  Top 0.813: JP8.1 U1.D14
  Bottom 0.406: v37.97,58.29 38.73,58.29 39.5,57.53 39.5,56.77 40.13,56.13 67.94,56.13 68.58,55.37 JP8.1
Y-STEP  (via drill 0.6)
  Top 0.813: v46.61,44.45 46.61,31.5 47.75,30.35 v47.75,25.53
  Bottom 0.813: v46.61,44.45 45.72,45.34 U1.D7 JP3.1 | v47.75,25.53 47.24,25.53 39.88,18.16 38.8,18.16 U$7.STEP

### Text on the board
_tsilk: S1 | S2 | 1 | S | + | - | IDTDB02 | + | Y+ | X+ | + | END STOPS | + | + | + | S | + | - | Polarshield v1.2 | + | www.polargraph.co.uk | 2012.11.02 #337893a | 1 | MOTORA | A | MS1 | MS2 | MS3 | SCL | SDA | + | GND | + | MOSI | D49 | SS | NC | MOTORB | AUX-3 | B | MS1 | MS2 | MS3 | VCC | MISO | SCK | GND | + | + | + | GND | + | +
_bsilk: Polarshield v1.2 | www.polargraph.co.uk | + | + | + | GND